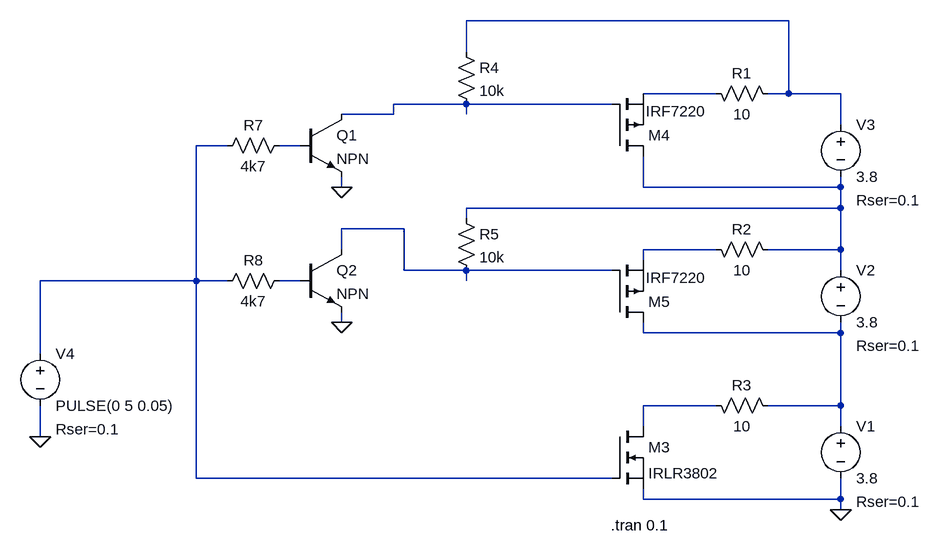
[diagram p0: schematic balancer_p.asc]
balancer_p.asc, the LTspice schematic file:
Version 4
SHEET 1 880 680
WIRE 64 -576 -432 -576
WIRE -432 -528 -432 -576
WIRE -48 -464 -160 -464
WIRE 64 -464 64 -576
WIRE 64 -464 32 -464
WIRE 144 -464 64 -464
WIRE -432 -448 -544 -448
WIRE -208 -448 -432 -448
WIRE -544 -432 -544 -448
WIRE -544 -432 -624 -432
WIRE -432 -432 -432 -448
WIRE 144 -416 144 -464
WIRE -800 -384 -848 -384
WIRE -688 -384 -720 -384
WIRE -624 -320 -624 -336
WIRE -160 -320 -160 -368
WIRE 144 -320 144 -336
WIRE 144 -320 -160 -320
WIRE 144 -288 144 -320
WIRE 144 -288 -432 -288
WIRE -432 -272 -432 -288
WIRE -528 -256 -624 -256
WIRE -624 -224 -624 -256
WIRE -48 -224 -160 -224
WIRE 144 -224 144 -288
WIRE 144 -224 32 -224
WIRE -160 -208 -160 -224
WIRE -528 -192 -528 -256
WIRE -432 -192 -528 -192
WIRE -208 -192 -432 -192
WIRE 144 -192 144 -224
WIRE -848 -176 -848 -384
WIRE -848 -176 -1088 -176
WIRE -800 -176 -848 -176
WIRE -688 -176 -720 -176
WIRE -432 -176 -432 -192
WIRE -624 -112 -624 -128
WIRE -160 -96 -160 -112
WIRE 144 -96 144 -112
WIRE 144 -96 -160 -96
WIRE -1088 -64 -1088 -176
WIRE -48 16 -160 16
WIRE 144 16 144 -96
WIRE 144 16 32 16
WIRE -160 48 -160 16
WIRE 144 48 144 16
WIRE -1088 64 -1088 16
WIRE -848 128 -848 -176
WIRE -208 128 -848 128
WIRE -160 160 -160 144
WIRE 144 160 144 128
WIRE 144 160 -160 160
WIRE 144 176 144 160
FLAG 144 176 0
FLAG -624 -320 0
FLAG -624 -112 0
FLAG -1088 64 0
SYMBOL voltage 144 32 R0
WINDOW 123 0 0 Left 0
WINDOW 39 24 132 Left 0
SYMATTR InstName V1
SYMATTR Value 3.8
SYMATTR SpiceLine Rser=0.1
SYMBOL voltage 144 -208 R0
WINDOW 123 0 0 Left 0
WINDOW 39 24 132 Left 0
SYMATTR InstName V2
SYMATTR Value 3.8
SYMATTR SpiceLine Rser=0.1
SYMBOL voltage 144 -432 R0
WINDOW 123 0 0 Left 0
WINDOW 39 24 132 Left 0
SYMATTR InstName V3
SYMATTR Value 3.8
SYMATTR SpiceLine Rser=0.1
SYMBOL res 48 -448 M270
WINDOW 0 32 56 VTop 0
WINDOW 3 0 56 VBottom 0
SYMATTR InstName R1
SYMATTR Value 10
SYMBOL res 48 -208 M270
WINDOW 0 32 56 VTop 0
WINDOW 3 0 56 VBottom 0
SYMATTR InstName R2
SYMATTR Value 10
SYMBOL res 48 32 M270
WINDOW 0 32 56 VTop 0
WINDOW 3 0 56 VBottom 0
SYMATTR InstName R3
SYMATTR Value 10
SYMBOL nmos -208 48 R0
SYMATTR InstName M3
SYMATTR Value IRLR3802
SYMBOL res -448 -544 R0
SYMATTR InstName R4
SYMATTR Value 10k
SYMBOL res -448 -288 R0
SYMATTR InstName R5
SYMATTR Value 10k
SYMBOL npn -688 -432 R0
SYMATTR InstName Q1
SYMBOL npn -688 -224 R0
SYMATTR InstName Q2
SYMBOL voltage -1088 -80 R0
WINDOW 123 0 0 Left 0
WINDOW 39 24 132 Left 0
SYMATTR InstName V4
SYMATTR Value PULSE(0 5 0.05)
SYMATTR SpiceLine Rser=0.1
SYMBOL res -704 -400 R90
WINDOW 0 0 56 VBottom 0
WINDOW 3 32 56 VTop 0
SYMATTR InstName R7
SYMATTR Value 4k7
SYMBOL res -704 -192 R90
WINDOW 0 0 56 VBottom 0
WINDOW 3 32 56 VTop 0
SYMATTR InstName R8
SYMATTR Value 4k7
SYMBOL pmos -208 -368 M180
WINDOW 3 52 69 Left 0
SYMATTR InstName M4
SYMATTR Value IRF7220
SYMBOL pmos -208 -112 M180
WINDOW 3 52 69 Left 0
SYMATTR InstName M5
SYMATTR Value IRF7220
TEXT -210 200 Left 0 !.tran 0.1

The netlist it stands for:
* balancer_p.asc
V1 N010 0 3.8 Rser=0.1
V2 N006 N010 3.8 Rser=0.1
V3 N001 N006 3.8 Rser=0.1
R1 N001 N002 10
R2 N006 N008 10
R3 N010 N011 10
M3 N011 N004 0 0 IRLR3802
R4 N001 N003 10k
R5 N006 N007 10k
Q1 N003 N005 0 0 NPN
Q2 N007 N009 0 0 NPN
V4 N004 0 PULSE(0 5 0.05) Rser=0.1
R7 N005 N004 4k7
R8 N009 N004 4k7
M4 N006 N003 N002 N002 IRF7220
M5 N010 N007 N008 N008 IRF7220
.model NPN NPN
.model PNP PNP
.lib standard.bjt
.model NMOS NMOS
.model PMOS PMOS
.lib standard.mos
.tran 0.1
.backanno
.end